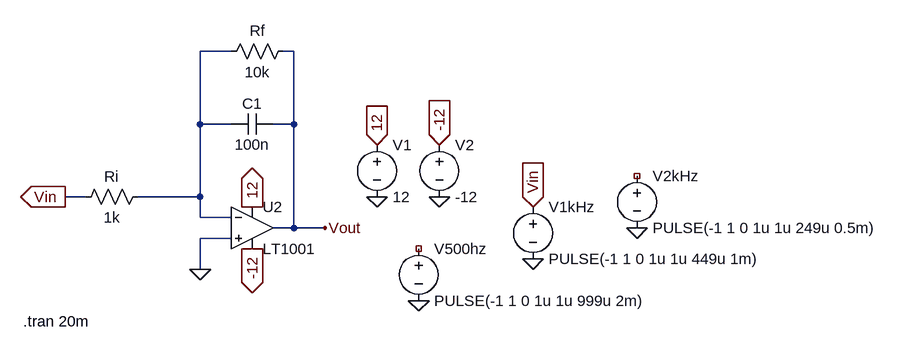
[diagram p0: schematic lab8.2.1.asc]
lab8.2.1.asc, the LTspice schematic file:
Version 4
SHEET 1 968 680
WIRE -48 -208 -96 -208
WIRE 48 -208 32 -208
WIRE -96 -96 -96 -208
WIRE -48 -96 -96 -96
WIRE 48 -96 48 -208
WIRE 48 -96 16 -96
WIRE -272 16 -304 16
WIRE -96 16 -96 -96
WIRE -96 16 -192 16
WIRE -96 48 -96 16
WIRE -48 48 -96 48
WIRE 48 64 48 -96
WIRE 48 64 16 64
WIRE 96 64 48 64
WIRE -48 80 -96 80
WIRE -96 128 -96 80
FLAG 176 16 0
FLAG 272 16 0
FLAG 176 -64 12
IOPIN 176 -64 In
FLAG -16 32 12
IOPIN -16 32 Out
FLAG 272 -64 -12
IOPIN 272 -64 In
FLAG -16 96 -12
IOPIN -16 96 Out
FLAG 416 32 Vin
IOPIN 416 32 In
FLAG -304 16 Vin
IOPIN -304 16 Out
FLAG 240 176 0
FLAG 96 64 Vout
FLAG -96 128 0
FLAG 416 112 0
FLAG 576 64 0
SYMBOL voltage 176 -80 R0
SYMATTR InstName V1
SYMATTR Value 12
SYMBOL voltage 272 -80 R0
SYMATTR InstName V2
SYMATTR Value -12
SYMBOL res -176 0 R90
WINDOW 0 0 56 VBottom 2
WINDOW 3 32 56 VTop 2
SYMATTR InstName Ri
SYMATTR Value 1k
SYMBOL voltage 240 80 R0
WINDOW 123 0 0 Left 0
WINDOW 39 0 0 Left 0
SYMATTR InstName V500hz
SYMATTR Value PULSE(-1 1 0 1u 1u 999u 2m)
SYMBOL cap 16 -112 R90
WINDOW 0 0 32 VBottom 2
WINDOW 3 32 32 VTop 2
SYMATTR InstName C1
SYMATTR Value 100n
SYMBOL res 48 -224 R90
WINDOW 0 0 56 VBottom 2
WINDOW 3 32 56 VTop 2
SYMATTR InstName Rf
SYMATTR Value 10k
SYMBOL voltage 416 16 R0
WINDOW 123 0 0 Left 0
WINDOW 39 0 0 Left 0
SYMATTR InstName V1kHz
SYMATTR Value PULSE(-1 1 0 1u 1u 449u 1m)
SYMBOL voltage 576 -32 R0
WINDOW 123 0 0 Left 0
WINDOW 39 0 0 Left 0
SYMATTR InstName V2kHz
SYMATTR Value PULSE(-1 1 0 1u 1u 249u 0.5m)
SYMBOL Opamps\\LT1001 -16 0 R0
SYMATTR InstName U2
TEXT -368 208 Left 2 !.tran 20m

The netlist it stands for:
* lab8.2.1.asc
V1 12 0 12
V2 -12 0 -12
Ri N001 Vin 1k
V500hz NC_01 0 PULSE(-1 1 0 1u 1u 999u 2m)
C1 Vout N001 100n
Rf Vout N001 10k
V1kHz Vin 0 PULSE(-1 1 0 1u 1u 449u 1m)
V2kHz NC_02 0 PULSE(-1 1 0 1u 1u 249u 0.5m)
XU2 0 N001 12 -12 Vout LT1001  ; pins In+ In- V+ V- OUT
.tran 20m
.lib LTC.lib
.backanno
.end